# Altium project Target Control System.PrjPcb
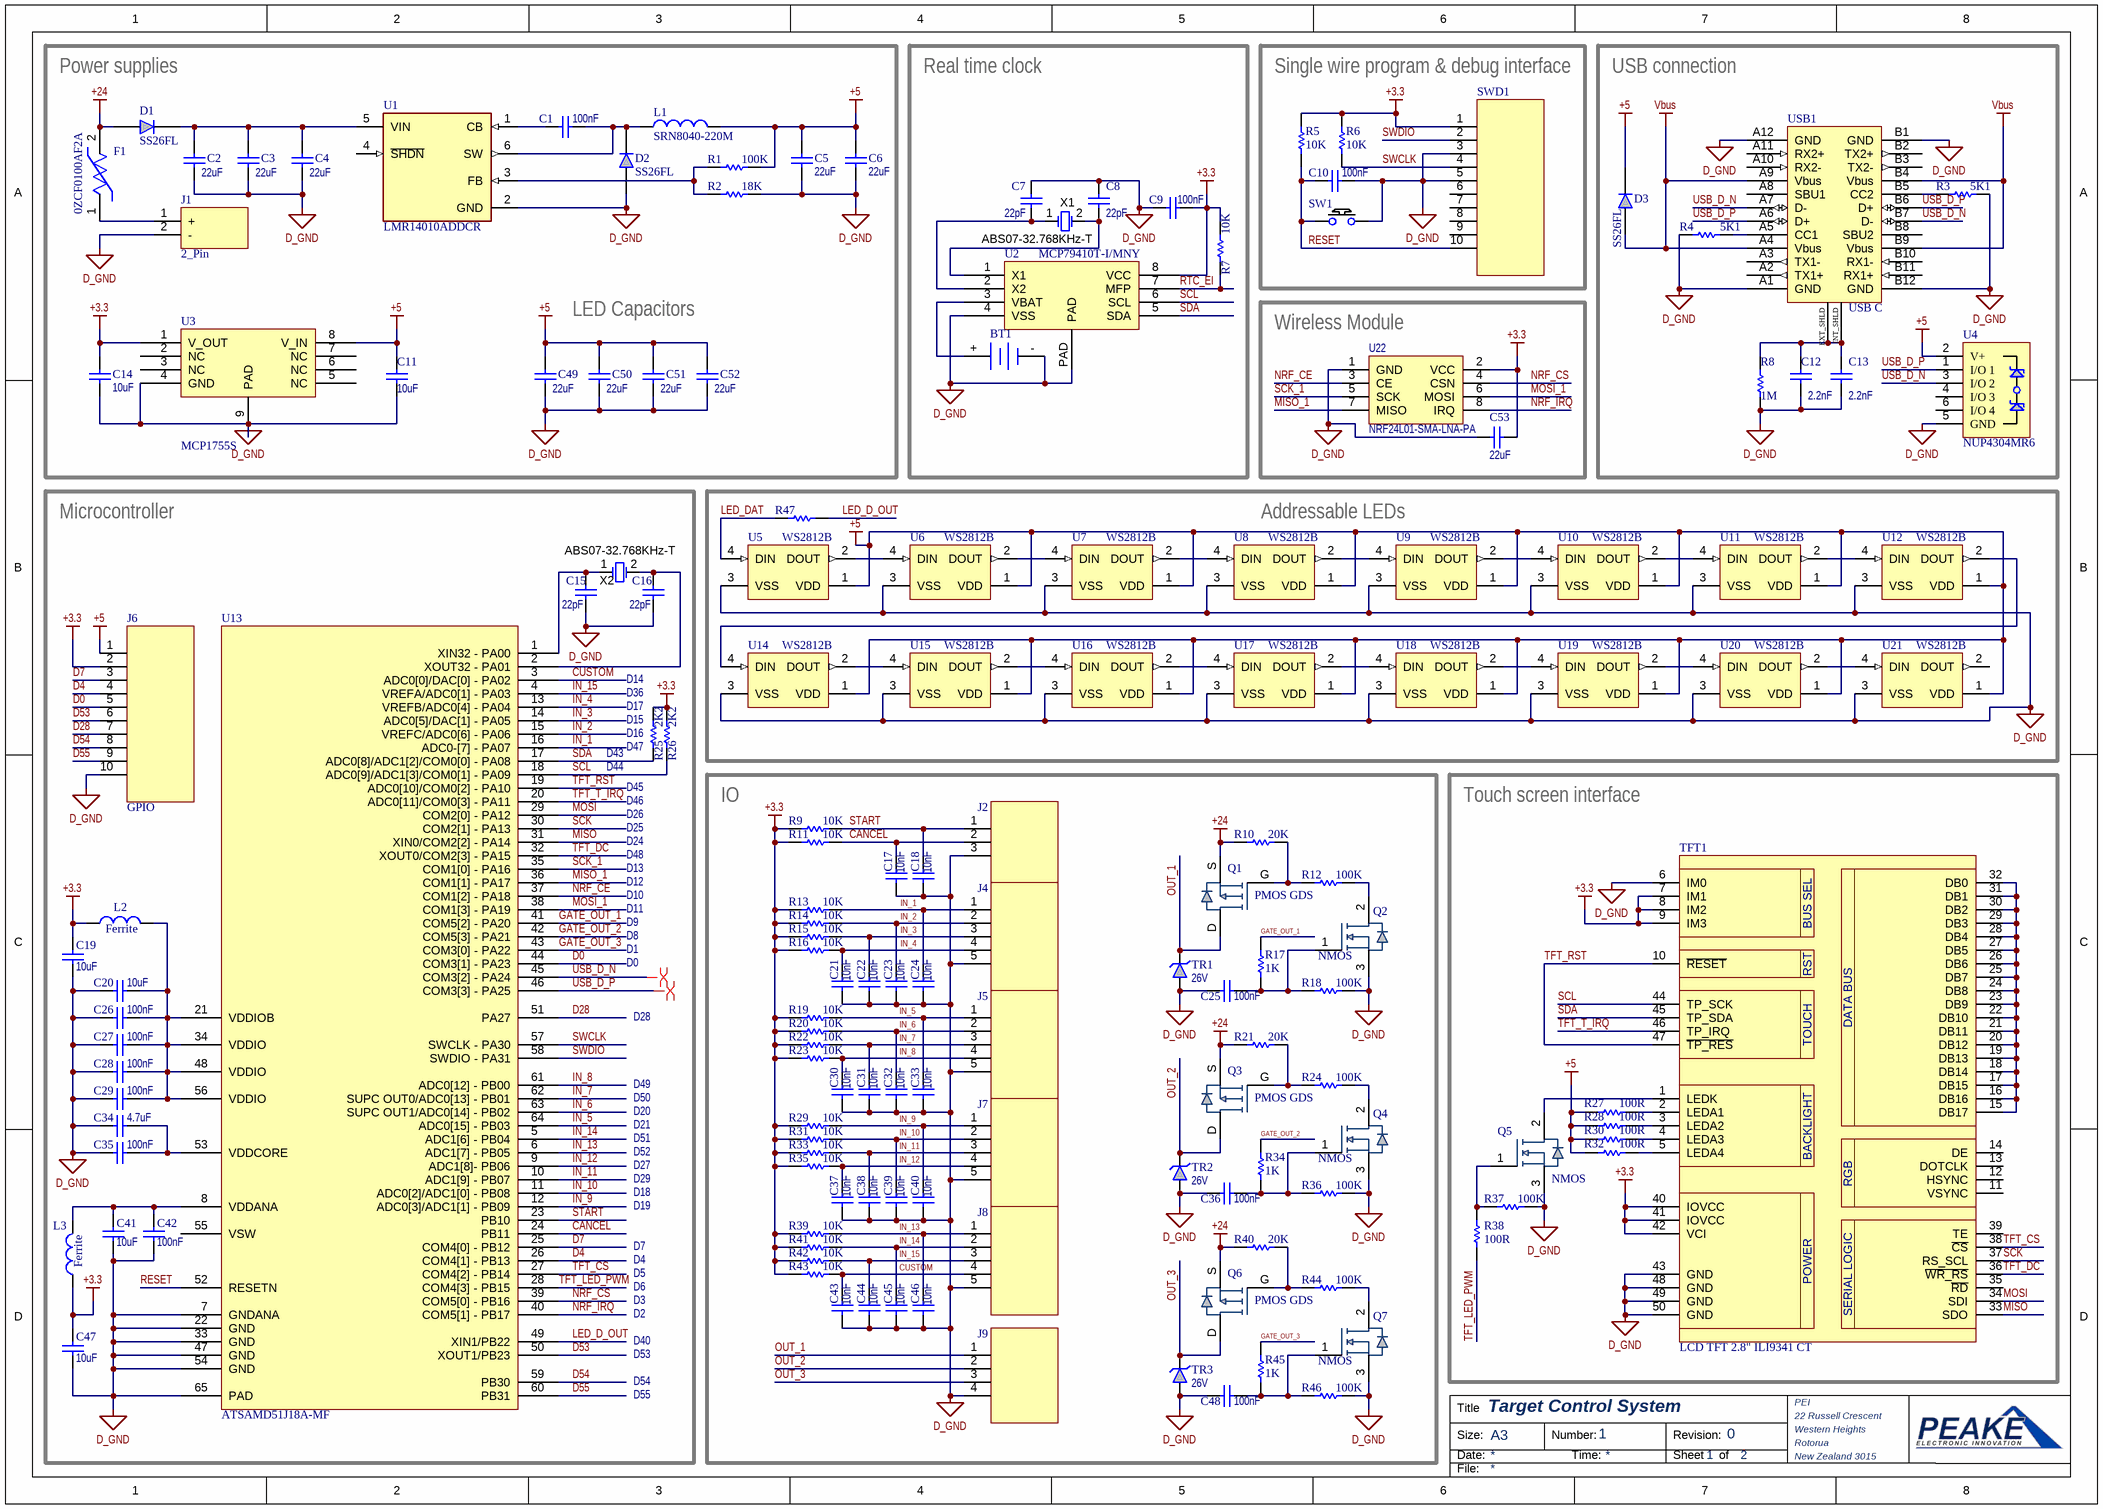
[diagram p0: Target Control System.SchDoc]
2 sheets, 162 parts. Net scope: global (net labels, ports and power ports of the same name join across sheets).
Board files: Target Control System.PcbDoc, Target Control System Front Panel.PcbDoc
Sheets:
  Target Control System.SchDoc
  Target Control System Front Panel.SchDoc

## Sheet Target Control System.SchDoc: Target Control System
size A3; Organization: PEI; Address1: 22 Russell Crescent; Address2: Western Heights; Address3: Rotorua; Address4: New Zealand 3015; DocumentNumber: 1; Revision: 0; SheetNumber: 1; SheetTotal: 2

### Parts
BT1  CR2032 Batt Holder  [CR2032 Batt Holder-Footprint-1]  (value not drawn)
C1  value 100nF  [0603_CAP]  (hidden comment: Capacitor)
C2  value 22uF  [0805_CAP]  (hidden comment: Capacitor)
C3  value 22uF  [0805_CAP]  (hidden comment: Capacitor)
C4  value 22uF  [0805_CAP]  (hidden comment: Capacitor)
C5  value 22uF  [0805_CAP]  (hidden comment: Capacitor)
C6  value 22uF  [0805_CAP]  (hidden comment: Capacitor)
C7  value 22pF  [0603_CAP]  (hidden comment: Capacitor)
C8  value 22pF  [0603_CAP]  (hidden comment: Capacitor)
C9  value 100nF  [0603_CAP]  (hidden comment: Capacitor)
C10  value 100nF  [0603_CAP]  (hidden comment: Capacitor)
C11  value 10uF  [0603_CAP]  (hidden comment: Capacitor)
C12  value 2.2nF  [0603_CAP]  (hidden comment: Capacitor)
C13  value 2.2nF  [0603_CAP]  (hidden comment: Capacitor)
C14  value 10uF  [0603_CAP]  (hidden comment: Capacitor)
C15  value 22pF  [0603_CAP]  (hidden comment: Capacitor)
C16  value 22pF  [0603_CAP]  (hidden comment: Capacitor)
C17  value 10nF  [0603_CAP]  (hidden comment: Capacitor)
C18  value 10nF  [0603_CAP]  (hidden comment: Capacitor)
C19  value 10uF  [0603_CAP]  (hidden comment: Capacitor)
C20  value 10uF  [0603_CAP]  (hidden comment: Capacitor)
C21  value 10nF  [0603_CAP]  (hidden comment: Capacitor)
C22  value 10nF  [0603_CAP]  (hidden comment: Capacitor)
C23  value 10nF  [0603_CAP]  (hidden comment: Capacitor)
C24  value 10nF  [0603_CAP]  (hidden comment: Capacitor)
C25  value 100nF  [0603_CAP]  (hidden comment: Capacitor)
C26  value 100nF  [0603_CAP]  (hidden comment: Capacitor)
C27  value 100nF  [0603_CAP]  (hidden comment: Capacitor)
C28  value 100nF  [0603_CAP]  (hidden comment: Capacitor)
C29  value 100nF  [0603_CAP]  (hidden comment: Capacitor)
C30  value 10nF  [0603_CAP]  (hidden comment: Capacitor)
C31  value 10nF  [0603_CAP]  (hidden comment: Capacitor)
C32  value 10nF  [0603_CAP]  (hidden comment: Capacitor)
C33  value 10nF  [0603_CAP]  (hidden comment: Capacitor)
C34  value 4.7uF  [0603_CAP]  (hidden comment: Capacitor)
C35  value 100nF  [0603_CAP]  (hidden comment: Capacitor)
C36  value 100nF  [0603_CAP]  (hidden comment: Capacitor)
C37  value 10nF  [0603_CAP]  (hidden comment: Capacitor)
C38  value 10nF  [0603_CAP]  (hidden comment: Capacitor)
C39  value 10nF  [0603_CAP]  (hidden comment: Capacitor)
C40  value 10nF  [0603_CAP]  (hidden comment: Capacitor)
C41  value 10uF  [0603_CAP]  (hidden comment: Capacitor)
C42  value 100nF  [0603_CAP]  (hidden comment: Capacitor)
C43  value 10nF  [0603_CAP]  (hidden comment: Capacitor)
C44  value 10nF  [0603_CAP]  (hidden comment: Capacitor)
C45  value 10nF  [0603_CAP]  (hidden comment: Capacitor)
C46  value 10nF  [0603_CAP]  (hidden comment: Capacitor)
C47  value 10uF  [0603_CAP]  (hidden comment: Capacitor)
C48  value 100nF  [0603_CAP]  (hidden comment: Capacitor)
C49  value 22uF  [0805_CAP]  (hidden comment: Capacitor)
C50  value 22uF  [0805_CAP]  (hidden comment: Capacitor)
C51  value 22uF  [0805_CAP]  (hidden comment: Capacitor)
C52  value 22uF  [0805_CAP]  (hidden comment: Capacitor)
C53  value 22uF  [0805_CAP]  (hidden comment: Capacitor)
D1  SS26FL  [MCC-SOD123_V]
D2  SS26FL  [MCC-SOD123_V]
D3  SS26FL  [MCC-SOD123_V]
F1  0ZCF0100AF2A  [FP-0ZCF0100AF2A-MFG]
J1  2_Pin  [2P MOLEX Micro-fit 3.0mm RA SR]
J2  3_Pin  [3P RA SMD MOLEX Clik-MATE 1.5mm]  (value not drawn)
J4  5_Pin  [5P RA SMD MOLEX Clik-MATE 1.5mm]  (value not drawn)
J5  5_Pin  [5P RA SMD MOLEX Clik-MATE 1.5mm]  (value not drawn)
J6  GPIO  [10P 2.54mm PTH Male Header]
J7  5_Pin  [5P RA SMD MOLEX Clik-MATE 1.5mm]  (value not drawn)
J8  5_Pin  [5P RA SMD MOLEX Clik-MATE 1.5mm]  (value not drawn)
J9  4_Pin  [4P MOLEX Micro-fit 3.0mm RA SR]  (value not drawn)
L1  SRN8040-220M  [BOUR-SRN8040_V]
L2  Ferrite  [1806_IND]
L3  Ferrite  [1806_IND]
Q1  PMOS GDS  [PowerDI 5060-8]
Q2  NMOS  [SOT-23]
Q3  PMOS GDS  [PowerDI 5060-8]
Q4  NMOS  [SOT-23]
Q5  NMOS  [SOT-23]
Q6  PMOS GDS  [PowerDI 5060-8]
Q7  NMOS  [SOT-23]
R1  value 100K  [0603_RES]  (hidden comment: Resistor)
R2  value 18K  [0603_RES]  (hidden comment: Resistor)
R3  value 5K1  [0603_RES]  (hidden comment: Resistor)
R4  value 5K1  [0603_RES]  (hidden comment: Resistor)
R5  value 10K  [0603_RES]  (hidden comment: Resistor)
R6  value 10K  [0603_RES]  (hidden comment: Resistor)
R7  value 10K  [0603_RES]  (hidden comment: Resistor)
R8  value 1M  [0603_RES]  (hidden comment: Resistor)
R9  value 10K  [0603_RES]  (hidden comment: Resistor)
R10  value 20K  [0603_RES]  (hidden comment: Resistor)
R11  value 10K  [0603_RES]  (hidden comment: Resistor)
R12  value 100K  [0603_RES]  (hidden comment: Resistor)
R13  value 10K  [0603_RES]  (hidden comment: Resistor)
R14  value 10K  [0603_RES]  (hidden comment: Resistor)
R15  value 10K  [0603_RES]  (hidden comment: Resistor)
R16  value 10K  [0603_RES]  (hidden comment: Resistor)
R17  value 1K  [0603_RES]  (hidden comment: Resistor)
R18  value 100K  [0603_RES]  (hidden comment: Resistor)
R19  value 10K  [0603_RES]  (hidden comment: Resistor)
R20  value 10K  [0603_RES]  (hidden comment: Resistor)
R21  value 20K  [0603_RES]  (hidden comment: Resistor)
R22  value 10K  [0603_RES]  (hidden comment: Resistor)
R23  value 10K  [0603_RES]  (hidden comment: Resistor)
R24  value 100K  [0603_RES]  (hidden comment: Resistor)
R25  value 2K2  [0603_RES]  (hidden comment: Resistor)
R26  value 2K2  [0603_RES]  (hidden comment: Resistor)
R27  value 100R  [0603_RES]  (hidden comment: Resistor)
R28  value 100R  [0603_RES]  (hidden comment: Resistor)
R29  value 10K  [0603_RES]  (hidden comment: Resistor)
R30  value 100R  [0603_RES]  (hidden comment: Resistor)
R31  value 10K  [0603_RES]  (hidden comment: Resistor)
R32  value 100R  [0603_RES]  (hidden comment: Resistor)
R33  value 10K  [0603_RES]  (hidden comment: Resistor)
R34  value 1K  [0603_RES]  (hidden comment: Resistor)
R35  value 10K  [0603_RES]  (hidden comment: Resistor)
R36  value 100K  [0603_RES]  (hidden comment: Resistor)
R37  value 100K  [0603_RES]  (hidden comment: Resistor)
R38  value 100R  [0603_RES]  (hidden comment: Resistor)
R39  value 10K  [0603_RES]  (hidden comment: Resistor)
R40  value 20K  [0603_RES]  (hidden comment: Resistor)
R41  value 10K  [0603_RES]  (hidden comment: Resistor)
R42  value 10K  [0603_RES]  (hidden comment: Resistor)
R43  value 10K  [0603_RES]  (hidden comment: Resistor)
R44  value 100K  [0603_RES]  (hidden comment: Resistor)
R45  value 1K  [0603_RES]  (hidden comment: Resistor)
R46  value 100K  [0603_RES]  (hidden comment: Resistor)
R47  Resistor  [0603_RES]  (value not drawn)
SW1  Button  [EVQP7A_SW]  (value not drawn)
SWD1  10_Pin  [DIP10_1.27_M_SMD]  (value not drawn)
TFT1  LCD TFT 2.8" ILI9341 CT  [LCD TFT 2.8" ILI9341 CT-Folded-OFFSET]
TR1  Rated Voltage: 26V  [SMBJ]  (hidden comment: Transil)
TR2  Rated Voltage: 26V  [SMBJ]  (hidden comment: Transil)
TR3  Rated Voltage: 26V  [SMBJ]  (hidden comment: Transil)
U1  LMR14010ADDCR  [FP-DDC0006A-IPC_A]
U2  MCP79410T-I/MNY  [MCP79410T-I_MNY-Footprint-1]
U3  MCP1755S  [8P 2x3 DFN]
U4  NUP4304MR6  [TSOP-6]
U5  WS2812B  [ADAI-WS2812B_V]
U6  WS2812B  [ADAI-WS2812B_V]
U7  WS2812B  [ADAI-WS2812B_V]
U8  WS2812B  [ADAI-WS2812B_V]
U9  WS2812B  [ADAI-WS2812B_V]
U10  WS2812B  [ADAI-WS2812B_V]
U11  WS2812B  [ADAI-WS2812B_V]
U12  WS2812B  [ADAI-WS2812B_V]
U13  ATSAMD51J18A-MF  [64M2 65P 9x9 VQFN ATSAME51J]
U14  WS2812B  [ADAI-WS2812B_V]
U15  WS2812B  [ADAI-WS2812B_V]
U16  WS2812B  [ADAI-WS2812B_V]
U17  WS2812B  [ADAI-WS2812B_V]
U18  WS2812B  [ADAI-WS2812B_V]
U19  WS2812B  [ADAI-WS2812B_V]
U20  WS2812B  [ADAI-WS2812B_V]
U21  WS2812B  [ADAI-WS2812B_V]
U22  NRF24L01-SMA-LNA-PA  [NRF24L01-SMA-LNA-PA-Footprint-1]
USB1  USB C  [12401598E4#2A]
X1  ABS07-32.768KHz-T  [ABRA-ABS07-2_V]
X2  ABS07-32.768KHz-T  [ABRA-ABS07-2_V]

### Blocks framed on the sheet
Real time clock: BT1 C7-C9 R7 U2 X1
Single wire program & debug interface: C10 R5 R6 SW1 SWD1
USB connection: C12 C13 D3 R3 R4 R8 U4 USB1
Wireless Module: C53 U22
Microcontroller: C15 C16 C19 C20 C26-C29 C34 C35 C41 C42 C47 J6 L2 L3 R25 R26 U13 X2
Addressable LEDs: R47 U5-U12 U14-U21
IO: C17 C18 C21-C25 C30-C33 C36-C40 C43-C46 C48 J2 J4 J5 J7-J9 Q1-Q4 Q6 Q7 R9-R24 R29 R31 R33-R36 R39-R46 TR1-TR3
Touch screen interface: Q5 R27 R28 R30 R32 R37 R38 TFT1

### Nets
+3.3: C9.1 C14.2 C19.1 C47.1 C53.1 J6.2 L2.1 L3.1 R5.2 R6.2 R7.2 R9.2 R11.2 R13.2 R14.2 R15.2 R16.2 R19.2 R20.2 R22.2 R23.2 R25.2 R26.2 R29.2 R31.2 R33.2 R35.2 R39.2 R41.2 R42.2 R43.2 SWD1.1 TFT1.7(IM1) TFT1.8(IM2) TFT1.9(IM3) TFT1.40(IOVCC) TFT1.41(IOVCC) TFT1.42(VCI) U2.8(VCC) U3.1(V_OUT) U22.2(VCC)
+5: C5.2 C6.2 C11.2 C49.2 C50.2 C51.2 C52.2 D3.2(K) J6.1 L1.2 R1.1 R27.2 R28.2 R30.2 R32.2 U3.8(V_IN) U4.2(V+) U5.1(VDD) U6.1(VDD) U7.1(VDD) U8.1(VDD) U9.1(VDD) U10.1(VDD) U11.1(VDD) U12.1(VDD) U14.1(VDD) U15.1(VDD) U16.1(VDD) U17.1(VDD) U18.1(VDD) U19.1(VDD) U20.1(VDD) U21.1(VDD)
+24: D1.1(A) F1.2 Q1.S Q3.S Q6.S R10.2 R21.2 R40.2
D_GND: BT1.- C2.1 C3.1 C4.1 C5.1 C6.1 C7.2 C8.2 C9.2 C10.1 C11.1 C12.1 C13.1 C14.1 C15.1 C16.1 C17.2 C18.2 C19.2 C20.2 C21.2 C22.2 C23.2 C24.2 C25.2 C26.2 C27.2 C28.2 C29.2 C30.2 C31.2 C32.2 C33.2 C34.2 C35.2 C36.2 C37.2 C38.2 C39.2 C40.2 C41.2 C42.2 C43.2 C44.2 C45.2 C46.2 C47.2 C48.2 C49.1 C50.1 C51.1 C52.1 C53.2 D2.1(A) J1.2(-) J2.3 J4.5 J5.5 J6.10 J7.5 J8.5 J9.4 Q2.3(S) Q4.3(S) Q5.3(S) Q7.3(S) R2.1 R3.1 R4.2 R8.1 R18.1 R36.1 R37.1 R46.1 SW1.2 SWD1.3 SWD1.5 TFT1.6(IM0) TFT1.43(GND) TFT1.48(GND) TFT1.49(GND) TFT1.50(GND) TR1.1(A) TR2.1(A) TR3.1(A) U1.2(GND) U2.4(VSS) U2.PAD U3.4(GND) U3.9(PAD) U4.5(GND) U5.3(VSS) U6.3(VSS) U7.3(VSS) U8.3(VSS) U9.3(VSS) U10.3(VSS) U11.3(VSS) U12.3(VSS) U13.7(GNDANA) U13.22(GND) U13.33(GND) U13.47(GND) U13.54(GND) U13.65(PAD) U14.3(VSS) U15.3(VSS) U16.3(VSS) U17.3(VSS) U18.3(VSS) U19.3(VSS) U20.3(VSS) U21.3(VSS) U22.1(GND) USB1.A1(GND) USB1.A12(GND) USB1.B1(GND) USB1.B12(GND)
Vbus: D3.1(A) USB1.A4(Vbus) USB1.A9(Vbus) USB1.B4(Vbus) USB1.B9(Vbus)
CANCEL: C17.1 J2.2 R11.1 U13.24(PB11)
CUSTOM: C43.1 J8.4 R43.1 U13.3(ADC0[0]/DAC[0]_-_PA02)
D0: J6.5 U13.44(COM3[1]_-_PA23)
D4: J6.4 U13.26(COM4[1]_-_PB13)
D7: J6.3 U13.25(COM4[0]_-_PB12)
D28: J6.7 U13.51(PA27)
D53: J6.6 U13.50(XOUT1/PB23)
D54: J6.8 U13.59(PB30)
D55: J6.9 U13.60(PB31)
GATE_OUT_1: R17.1 U13.41(COM5[2]_-_PA20)
GATE_OUT_2: R34.1 U13.42(COM5[3]_-_PA21)
GATE_OUT_3: R45.1 U13.43(COM3[0]_-_PA22)
IN_1: C24.1 J4.1 R13.1 U13.16(ADC0-[7]_-_PA07)
IN_2: C23.1 J4.2 R14.1 U13.15(VREFC/ADC0[6]_-_PA06)
IN_3: C22.1 J4.3 R15.1 U13.14(ADC0[5]/DAC[1]_-_PA05)
IN_4: C21.1 J4.4 R16.1 U13.13(VREFB/ADC0[4]_-_PA04)
IN_5: C33.1 J5.1 R19.1 U13.64(ADC0[15]_-_PB03)
IN_6: C32.1 J5.2 R20.1 U13.63(SUPC_OUT1/ADC0[14]_-_PB02)
IN_7: C31.1 J5.3 R22.1 U13.62(SUPC_OUT0/ADC0[13]_-_PB01)
IN_8: C30.1 J5.4 R23.1 U13.61(ADC0[12]_-_PB00)
IN_9: C40.1 J7.1 R29.1 U13.12(ADC0[3]/ADC1[1]_-_PB09)
IN_10: C39.1 J7.2 R31.1 U13.11(ADC0[2]/ADC1[0]_-_PB08)
IN_11: C38.1 J7.3 R33.1 U13.10(ADC1[9]_-_PB07)
IN_12: C37.1 J7.4 R35.1 U13.9(ADC1[8]-_PB06)
IN_13: C46.1 J8.1 R39.1 U13.6(ADC1[7]_-_PB05)
IN_14: C45.1 J8.2 R41.1 U13.5(ADC1[6]_-_PB04)
IN_15: C44.1 J8.3 R42.1 U13.4(VREFA/ADC0[1]_-_PA03)
LED_D_OUT: R47.1 U13.49(XIN1/PB22)
LED_DAT: R47.2 U5.4(DIN)
MISO: TFT1.33(SDO) U13.31(XIN0/COM2[2]_-_PA14)
MISO_1: U13.36(COM1[1]_-_PA17) U22.7(MISO)
MOSI: TFT1.34(SDI) U13.29(COM2[0]_-_PA12)
MOSI_1: U13.38(COM1[3]_-_PA19) U22.6(MOSI)
NRF_CE: U13.37(COM1[2]_-_PA18) U22.3(CE)
NRF_CS: U13.39(COM5[0]_-_PB16) U22.4(CSN)
NRF_IRQ: U13.40(COM5[1]_-_PB17) U22.8(IRQ)
OUT_1: J9.1 Q1.D TR1.2(K)
OUT_2: J9.2 Q3.D TR2.2(K)
OUT_3: J9.3 Q6.D TR3.2(K)
RESET: C10.2 R5.1 SW1.1 SWD1.10 U13.52(RESETN)
RTC_EI: R7.1 U2.7(MFP)
SCK: TFT1.37(RS_SCL) U13.30(COM2[1]_-_PA13)
SCK_1: U13.35(COM1[0]_-_PA16) U22.5(SCK)
SCL: R26.1 TFT1.44(TP_SCK) U2.6(SCL) U13.18(ADC0[9]/ADC1[3]/COM0[1]_-_PA09)
SDA: R25.1 TFT1.45(TP_SDA) U2.5(SDA) U13.17(ADC0[8]/ADC1[2]/COM0[0]_-_PA08)
START: C18.1 J2.1 R9.1 U13.23(PB10)
SWCLK: R6.1 SWD1.4 U13.57(SWCLK_-_PA30)
SWDIO: SWD1.2 U13.58(SWDIO_-_PA31)
TFT_CS: TFT1.38(~{CS}) U13.27(COM4[2]_-_PB14)
TFT_DC: TFT1.36(~{WR_RS}) U13.32(XOUT0/COM2[3]_-_PA15)
TFT_LED_PWM: R38.1 U13.28(COM4[3]_-_PB15)
TFT_RST: TFT1.10(~{RESET}) TFT1.47(~{TP_RES}) U13.19(ADC0[10]/COM0[2]_-_PA10)
TFT_T_IRQ: TFT1.46(TP_IRQ) U13.20(ADC0[11]/COM0[3]_-_PA11)
USB_D_N: U4.3(I/O_2) U13.45(COM3[2]_-_PA24) USB1.A7(D-) USB1.B7(D-)
USB_D_P: U4.1(I/O_1) U13.46(COM3[3]_-_PA25) USB1.A6(D+) USB1.B6(D+)
NetBT1_+: BT1.+ U2.3(VBAT)
NetC1_1: C1.1 U1.1(CB)
NetC1_2: C1.2 D2.2(K) L1.1 U1.6(SW)
NetC2_2: C2.2 C3.2 C4.2 D1.2(K) U1.5(VIN)
NetC7_1: C7.1 U2.2(X2) X1.1(OSC1)
NetC8_1: C8.1 U2.1(X1) X1.2(OSC2)
NetC12_2: C12.2 C13.2 R8.2 USB1.EXT_SHLD USB1.INT_SHLD
NetC15_2: C15.2 U13.1(XIN32_-_PA00) X2.1(OSC1)
NetC16_2: C16.2 U13.2(XOUT32_-_PA01) X2.2(OSC2)
NetC20_1: C20.1 C26.1 C27.1 C28.1 C29.1 L2.2 U13.21(VDDIOB) U13.34(VDDIO) U13.48(VDDIO) U13.56(VDDIO)
NetC25_1: C25.1 Q2.1(G) R17.2 R18.2
NetC34_1: C34.1 C35.1 U13.53(VDDCORE)
NetC36_1: C36.1 Q4.1(G) R34.2 R36.2
NetC41_1: C41.1 C42.1 L3.2 U13.8(VDDANA)
NetC48_1: C48.1 Q7.1(G) R45.2 R46.2
NetF1_1: F1.1 J1.1(+)
NetQ1_G: Q1.G R10.1 R12.2
NetQ2_2: Q2.2(D) R12.1
NetQ3_G: Q3.G R21.1 R24.2
NetQ4_2: Q4.2(D) R24.1
NetQ5_1: Q5.1(G) R37.2 R38.2
NetQ5_2: Q5.2(D) TFT1.1(LEDK)
NetQ6_G: Q6.G R40.1 R44.2
NetQ7_2: Q7.2(D) R44.1
NetR1_2: R1.2 R2.2 U1.3(FB)
NetR3_2: R3.2 USB1.B5(CC2)
NetR4_1: R4.1 USB1.A5(CC1)
NetR27_1: R27.1 TFT1.2(LEDA1)
NetR28_1: R28.1 TFT1.3(LEDA2)
NetR30_1: R30.1 TFT1.4(LEDA3)
NetR32_1: R32.1 TFT1.5(LEDA4)
NetTFT1_15: TFT1.15(DB17) TFT1.16(DB16) TFT1.17(DB15) TFT1.18(DB14) TFT1.19(DB13) TFT1.20(DB12) TFT1.21(DB11) TFT1.22(DB10) TFT1.23(DB9) TFT1.24(DB8) TFT1.25(DB7) TFT1.26(DB6) TFT1.27(DB5) TFT1.28(DB4) TFT1.29(DB3) TFT1.30(DB2) TFT1.31(DB1) TFT1.32(DB0)
NetU5_2: U5.2(DOUT) U6.4(DIN)
NetU6_2: U6.2(DOUT) U7.4(DIN)
NetU7_2: U7.2(DOUT) U8.4(DIN)
NetU8_2: U8.2(DOUT) U9.4(DIN)
NetU9_2: U9.2(DOUT) U10.4(DIN)
NetU10_2: U10.2(DOUT) U11.4(DIN)
NetU11_2: U11.2(DOUT) U12.4(DIN)
NetU12_2: U12.2(DOUT) U14.4(DIN)
NetU14_2: U14.2(DOUT) U15.4(DIN)
NetU15_2: U15.2(DOUT) U16.4(DIN)
NetU16_2: U16.2(DOUT) U17.4(DIN)
NetU17_2: U17.2(DOUT) U18.4(DIN)
NetU18_2: U18.2(DOUT) U19.4(DIN)
NetU19_2: U19.2(DOUT) U20.4(DIN)
NetU20_2: U20.2(DOUT) U21.4(DIN)

Not connected (* = marked no-connect by the designer): SWD1 6 7 8 9; TFT1 11(VSYNC) 12(HSYNC) 13(DOTCLK) 14(DE) 35(~{RD}) 39(TE); U1 4(~{SHDN}); U3 2(NC) 3(NC) 5(NC) 6(NC) 7(NC); U4 4(I/O_3) 6(I/O_4); U13 55(VSW); U21 2(DOUT); USB1 A2(TX1+) A3(TX1-) A8(SBU1) A10(RX2-) A11(RX2+) B2(TX2+) B3(TX2-) B8(SBU2) B10(RX1-) B11(RX1+)

### Layout directives
differential pair: USB_D_N, USB_D_P

### Notes on the sheet
- Power supplies
- LED Capacitors
- D14
- (near R25) D15
- (near R25) D17
- D36
- D43
- D44
- (near R25) D16
- (near R25) D47
- D24
- D25
- D26
- D45
- D46
- D48
- D11
- D12
- D13
- D10
- D0
- D1
- D8
- D9
- D28
- D20
- D21
- D49
- D50
- D27
- D29
- D51
- D52
- D4
- D7
- D18
- D19
- D2
- D3
- D5
- D6
- D40
- D53
- D54
- D55
- Title
- Size:
- Date:
- A3
- Number:
- Time:
- Revision:
- Sheet
- of
- File:
- (in symbol CMP-086-000000-2) BUS SEL; RST; DATA BUS; TOUCH; BACKLIGHT; RGB; POWER; SERIAL LOGIC

### Library data of the parts
BT1 = CMP-079-000035-2: SMD CR2032 coin cell holder; Component Type: Standard; Pin Count: 2; Source: All Components - 30.06.23 - 18.27.SchLib; Design Item ID: CMP-00042-2
C1-C53 = CMP-001-00172-1: SMD Capacitor; Pins: 2; Source: Discrete.SchLib; Component Type: Standard; Design Item ID: Capacitor
D1-D3 = CMP-004-00049-2: ON SEMICONDUCTOR - SS26FL - Schottky Rectifier, 60 V, 2 A, Single, SOD-123F, 2 Pins, 700 mV; Max Repetitive Reverse Voltage (Vrrm): 60V; Reverse Recovery Time: 8.26ns; Max Forward Surge Current (Ifsm): 50A; Average Rectified Current: 2A; Mount: Surface Mount; Max Reverse Voltage (DC): 60V; Element Configuration: Single; Weight: 0.0276g; Packaging: Tape and Reel; Case/Package: SOD; Design Item ID: CMP-00008-4; Pin Count: 2; Source: All Components - 30.06.23 - 18.27.SchLib; Component Type: Standard
F1 = CMP-005-00014-2: PTC Resettable Fuse 100A 0.5s 60VDC 0.09 Ohm 2-Pin 2920 T/R; Trip Current: 2A; Hold Current: 1A; Time to Trip: 500ms; Packaging: Cut Tape; Width: 0.202inch; Max Operating Temperature: 85°C; Max Current Rating: 100A; Series: 0ZCF; Case Code (Metric): 7351; Min Operating Temperature: -40°C; Length: 0.29inch; Mount: Surface Mount; RoHS Compliant: Yes; Thickness: 0.067inch; Pins: 2; Component Type: Standard; Source: All Components - 30.06.23 - 18.27.SchLib; Design Item ID: CMP-00051-1; Case/Package: 2920
J1 = CMP-002-00173-1: 2 Pin Connector; MFN: *; Pins: 2; Source: Connectors.SchLib; Component Type: Standard; Design Item ID: 2_Pin; Pin Count: 2
J2 = CMP-002-00174-1: 3 Pin Connector; Design Item ID: 3_Pin; Component Type: Standard; Pins: 3; Source: Connectors.SchLib; Pin Count: 3
J4 J5 J7 J8 = CMP-002-00179-1: 5 Pin Connector; Source: Connectors.SchLib; Pins: 5; Design Item ID: 5_Pin; Component Type: Standard; Pin Count: 5
J6 SWD1 = CMP-002-00170-1: 10 Pin Connector; Pins: 10; Component Type: Standard; Design Item ID: 10_Pin; Source: Connectors.SchLib; Pin Count: 10
J9 = CMP-002-00177-1: 4 Pin Connector; Component Type: Standard; Source: Connectors.SchLib; Pins: 4; Design Item ID: 4_Pin; Pin Count: 4
L1 = CMP-006-00027-2: Inductor;  Power;  Semi-Shielded;  Ind 22 uH;  Tol 20%;  Cur-Rtg 2.2 A;  SMT; DC Resistance (DCR): 100mR; Material: Steel; Max DC Current: 2.2A; Core Material: Ferrite; Inductance: 22uH; Test Frequency: 100kHz; Self Resonant Frequency: 12MHz; Max Operating Temperature: 125°C; Case/Package: Nonstandard; Military Standard: Not; Package Quantity: 1000; Depth: 8.3mm; Resistor Type: Wirewound; Packaging: Tape and Reel; Shielding: Shielded; Current Rating: 2.2A; Height - Seated (Max): 0.157inch; Tolerance: 20%; REACH SVHC: No SVHC; Saturation Current: 2.2A; RMS Current (Irms): 2.2A; Min Operating Temperature: -40°C; Length: 8mm; Termination: SMD/SMT; Mount: Surface Mount; Inductance Tolerance: 20%; DC Current: 2.2A; Width: 8mm; Height: 4mm; Pins: 2; Design Item ID: CMP-00009-2; Component Type: Standard; Pin Count: 2; Source: All Components - 30.06.23 - 18.27.SchLib
L2 L3 = CMP-006-00051-1: MFN: Z1806C560BPWST; Pins: 2; Component Type: Standard; Design Item ID: Ferrite; Source: Discrete.SchLib; Pin Count: 2
Q1 Q3 Q6 = CMP-079-000102-2: P Channel MOSFET; Pin Count: 3; MFN: *; Component Type: Standard; Source: P-MOS.SchLib; Design Item ID: PMOS GDS; Continuous Current: *; VGS Max: *; VDS Breakdown: *
Q2 Q4 Q5 Q7 = CMP-079-000093-1: N Channel MOSFET; Pin Count: 3; Design Item ID: NMOS; Component Type: Standard; MFN: *; Source: N-MOS.SchLib
R1-R47 = CMP-009-00356-1: SMD Resistor; Component Type: Standard; Source: Discrete.SchLib; Design Item ID: Resistor; Pins: 2
SW1 = CMP-079-000142-2: Momentary push button; Component Type: Standard; Design Item ID: Button; Pins: 2; Source: Discrete.SchLib; Pin Count: 2
TFT1 = CMP-086-000000-2: 2.8" colour LCD screen with capacitive touch, ILI9341 display driver and FT6236 capacitive touch driver.; Source: ILI9341 CT.SchLib; Design Item ID: CMP-00028-6
TR1-TR3 = CMP-079-000108-2: Transient Voltage Suppressor; Clamping Voltage: *; Design Item ID: Transil; Pin Count: 2; Breakdown Voltage: *; Component Type: Standard; Source: Discrete.SchLib; MFN: *
U1 = CMP-079-000005-3: LV2843; Max Input Voltage: 40V; Synchronous Rectifier: No; Min Input Voltage: 4V; Min Output Voltage: 765mV; Output Configuration: Positive; Number of Outputs: 1; Output Current: 1A; Switching Frequency: 850kHz; Output Type: Adjustable; Packaging: Cut Tape; Min Operating Temperature: -40°C; Case/Package: SOT-23-6; Features: UVLO; Max Output Voltage: 40V; Mount: Surface Mount; Max Operating Temperature: 125°C; Design Item ID: CMP-00007-1; Source: All Components - 30.06.23 - 18.27.SchLib; Pin Count: 6; Component Type: Standard
U2 = CMP-00029-00016-2: Real Time Clock Serial 64byte Clock/Calendar/Alarm/Battery Backup Automotive 8-Pin TDFN EP T/R; Max Supply Voltage: 5.5V; Min Supply Voltage: 1.8V; Interface: I2C,Serial,2-Wire; Time Format: HH:MM:SS; Memory Size: 64B; Date Format: YY-MM-DD-dd; Lead Free: Lead Free; Case/Package: DFN; Weight: 0.001319oz; Length: 0.078inch; Max Operating Temperature: 85°C; Radiation Hardening: No; Packaging: Tape and Reel; Mount: Surface Mount; Package Quantity: 3300; Width: 0.118inch; Supply Voltage-Nom: 5.5V; Height: 0.03inch; Min Operating Temperature: -40°C; Logic Function: Clock; RoHS Compliant: Yes; Design Item ID: CMP-00046-1; Component Type: Standard; Source: All Components - 30.06.23 - 18.27.SchLib; Pins: 8; Pin Count: 9
U3 = CMP-079-000090-2: LDO Linear Voltage Regulator; Source: Microchip.SchLib; Pin Count: 9; Component Type: Standard; Design Item ID: MCP1755S
U4 = CMP-079-000096-2: ESD Protection Doide Array; Source: ON Semi.SchLib; Pin Count: 6; Design Item ID: NUP4304MR6; Component Type: Standard
U5-U12 U14-U21 = CMP-079-000113-2: Intelligent Control LED Integrated Light Source, 3.5 to 5.3 V, -25 to 80 degC, 4-Pin SMD, RoHS, Bulk; Manufacturer: Adafruit Industries; Package Description: 4-Pin Surface Mount Device, Body 5 x 5 mm, Pitch 3.3 mm; Mounting Technology: SM; Package Reference: WS2812B; Case/Package: WS2812B; Datasheet Version: May-13; Manufacturer URL: https://www.adafruit.com/; RoHS Compliant: False; Datasheet URL: https://cdn-shop.adafruit.com/datasheets/WS2812B.pdf; Component Type: Standard; Source: All Components - 30.06.23 - 18.27.SchLib; Pin Count: 4; Design Item ID: CMP-007-00035-3
U13 = CMP-031-00049-2: MCU 32-Bit ARM Cortex-M4F RISC 256KB Flash 1.71V to 3.63V 64-Pin QFN Tray; Pin Count: 65; Component Type: Standard; Source: All Components - 30.06.23 - 18.27.SchLib; Design Item ID: CMP-00048-1
U22 = NRF24L01-SMA-LNA-PA-Symbol-1: NRF 2.4GHz wireless transciever module
USB1 = CMP-079-000004-2: Vertical or RA Type C Usb Connector Rohs Compliant: Yes; Source: All Components - 30.06.23 - 18.27.SchLib; Design Item ID: CMP-00005-5; Pin Count: 26; Component Type: Standard
X1 X2 = CMP-003-00061-3: Low Profile Crystal, 32.768 kHz, +/- 20 ppm, 12.5 pF, -40 to 85 degC, 2-Pin SMD, Pb-Free, Tape and Reel; Manufacturer: Abracon; Tolerance: 20ppm; Load Capacitance: 12.5pF; ESR: 70k; Case/Package: CSMD; Datasheet Version: Aug-15; Pins: 2; Max Operating Temperature: 85°C; Package Description: 2-Pin Surface Mount Device, Body 3.2 x 1.5 mm; Manufacturer URL: http://www.abracon.com/; Package URL: http://www.abracon.com/Support/PackageDrawing/Resonators/ABS07.PDF; Min Operating Temperature: -40°C; Packaging: TapeandReel; RoHS Compliant: True; Package Reference: ABS07-2; Frequency Tolerance: 20ppm; Frequency: 32.768kHz; Datasheet URL: http://www.abracon.com/Resonators/ABS07.pdf; Package Quantity: 3000; Mounting Technology: SM; Component Type: Standard; Source: All Components - 30.06.23 - 18.27.SchLib; Design Item ID: CMP-003-00022-1

## Sheet Target Control System Front Panel.SchDoc: Front Panel
size A4; Organization: PEI; Address1: 22 Russell Crescent; Address2: Western Heights; Address3: Rotorua; Address4: New Zealand 3015; DocumentNumber: n/a; Revision: 0; SheetNumber: 2; SheetTotal: 2
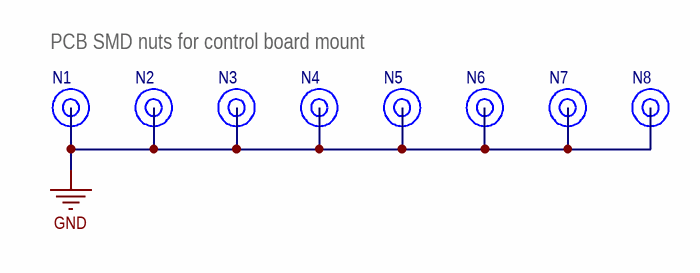
[diagram p1: Target Control System Front Panel.SchDoc]

### Parts
N1  PCB Nut  [PCB Nut M3 SMD]  (value not drawn)
N2  PCB Nut  [PCB Nut M3 SMD]  (value not drawn)
N3  PCB Nut  [PCB Nut M3 SMD]  (value not drawn)
N4  PCB Nut  [PCB Nut M3 SMD]  (value not drawn)
N5  PCB Nut  [PCB Nut M3 SMD]  (value not drawn)
N6  PCB Nut  [PCB Nut M3 SMD]  (value not drawn)
N7  PCB Nut  [PCB Nut M3 SMD]  (value not drawn)
N8  PCB Nut  [PCB Nut M3 SMD]  (value not drawn)

### Nets
GND: N1.1 N2.1 N3.1 N4.1 N5.1 N6.1 N7.1 N8.1

### Notes on the sheet
- PCB SMD nuts for control board mount
- Title
- Size:
- Date:
- A4
- Number:
- Time:
- Revision:
- Sheet
- of
- File:

### Library data of the parts
N1-N8 = CMP-00059-2: SMD or through hole soldered PCB nut; MFN: SMTWE2035MTJ; Thread: M2 x 0.4; Length: 4.9mm; Mount style: SMD